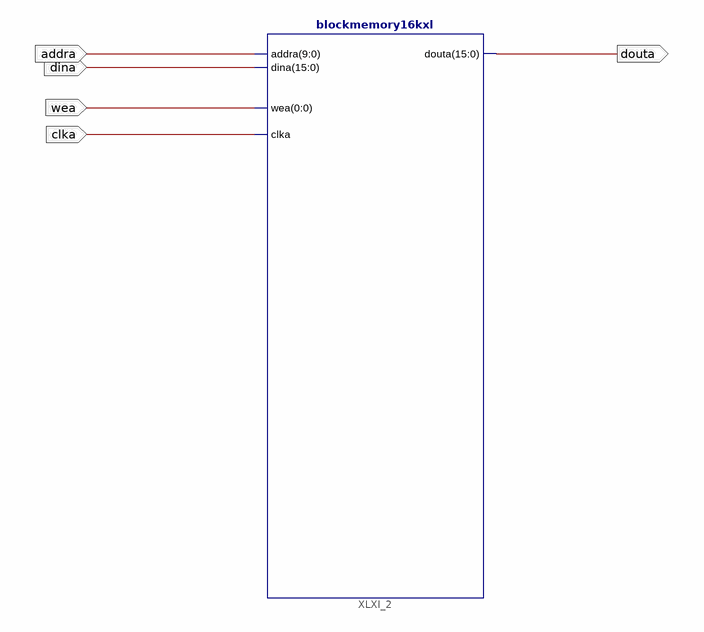
[diagram p0: schematic sheet 1]
// Xilinx ISE schematic something.sch (spartan3e) as structural Verilog: 1 symbols, 5 ports
module something (
  input  dina,
  input  addra,
  input  wea,
  input  clka,
  output douta
);

  blockmemory16kxl XLXI_2 (.addra({10{addra}}), .dina({16{dina}}), .wea(wea), .clka(clka), .douta({16{douta}}));
endmodule
